# EAGLE design soil moisure (EAGLE 9.6.2)
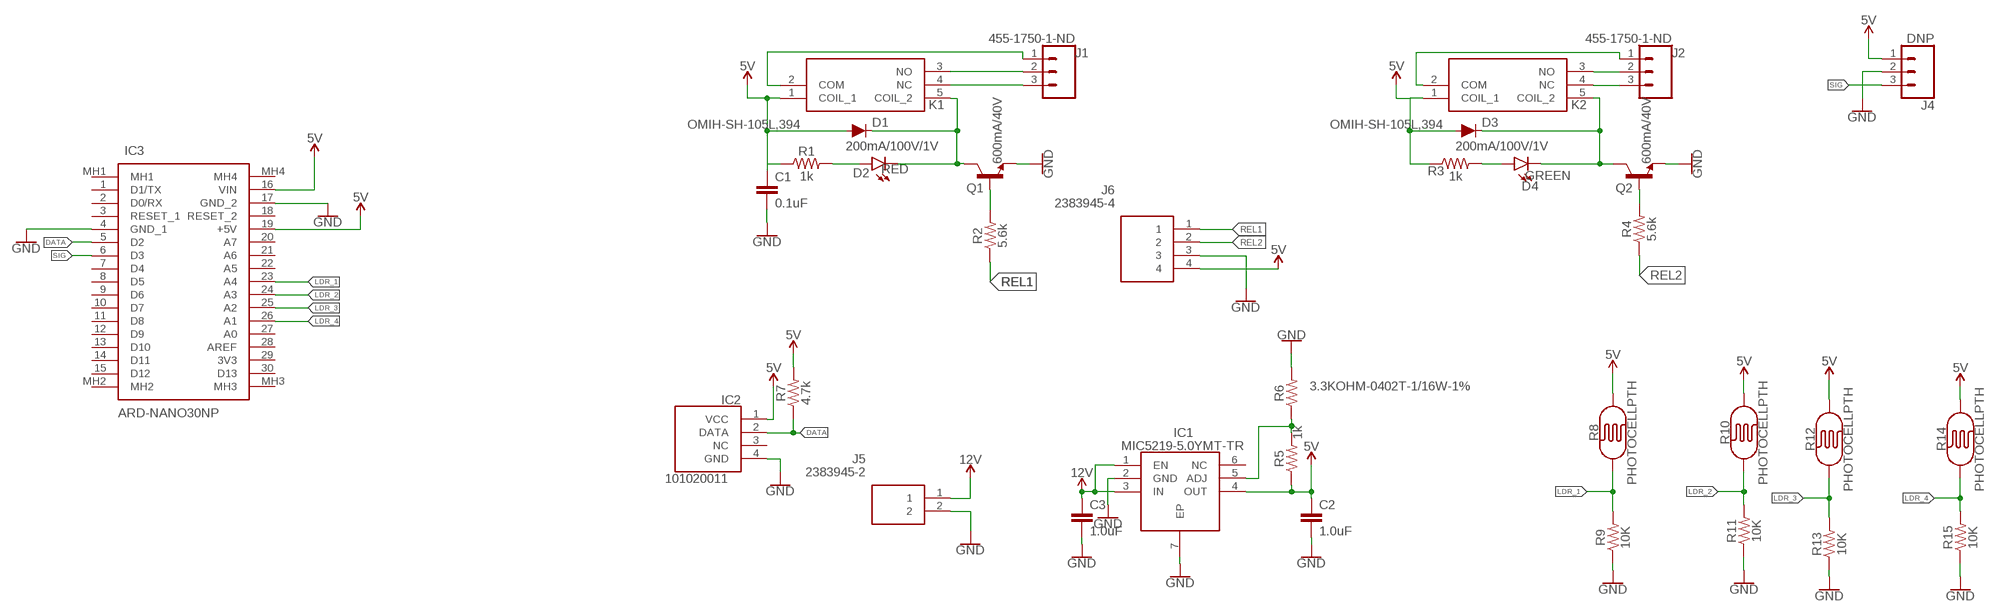
[diagram p0: schematic, sheet 1]

## Parts
C1  0.1uF  0.1UF-0402T-6.3V-10%-X7R  [0402-TIGHT]
C2  1.0uF  1.0UF-0402T-16V-10%  [0402-TIGHT]
C3  1.0uF  1.0UF-0402T-16V-10%  [0402-TIGHT]
D1  200mA/100V/1V  DIODE-1N4148  [DIODE-1N4148]
D2  RED  LED-RED0603  [LED-0603]
D3  200mA/100V/1V  DIODE-1N4148  [DIODE-1N4148]
D4  GREEN  LED-GREEN0603  [LED-0603]
IC1  MIC5219-5.0YMT-TR  [SON65P200X200X60-7N]
IC2  101020011  [HDRV4W80P0X254_1X4_1200X500X15]
IC3  ARD-NANO30NP  [ARDNANO30NP]
J1  455-1750-1-ND  CONN_03  [1X03]
J2  455-1750-1-ND  CONN_03  [1X03]
J4  DNP  CONN_03POLAR  [MOLEX-1X3]
J5  2383945-2  [23839452]
J6  2383945-4  [23839454]
K1  OMIH-SH-105L,394  [OMIHSH105L394]
K2  OMIH-SH-105L,394  [OMIHSH105L394]
Q1  600mA/40V  TRANS_NPN-MMBT2222AL  [SOT23-3]
Q2  600mA/40V  TRANS_NPN-MMBT2222AL  [SOT23-3]
R1  1k  1KOHM-0402T-1/16W-1%  [0402-TIGHT]
R2  5.6k  5.6KOHM-0603-1/10W-1%  [0603]
R3  1k  1KOHM-0402T-1/16W-1%  [0402-TIGHT]
R4  5.6k  5.6KOHM-0603-1/10W-1%  [0603]
R5  1k  1KOHM-0402T-1/16W-1%  [0402-TIGHT]
R6  3.3KOHM-0402T-1/16W-1%  [0402-TIGHT]
R7  4.7k  4.7KOHM-0402T-1/16W-1%  [0402-TIGHT]
R8  PHOTOCELLPTH  [PHOTOCELL]
R9  10K  10KOHM-0402-1/10W-0.1%  [0402-TIGHT]
R10  PHOTOCELLPTH  [PHOTOCELL]
R11  10K  10KOHM-0402-1/10W-0.1%  [0402-TIGHT]
R12  PHOTOCELLPTH  [PHOTOCELL]
R13  10K  10KOHM-0402-1/10W-0.1%  [0402-TIGHT]
R14  PHOTOCELLPTH  [PHOTOCELL]
R15  10K  10KOHM-0402-1/10W-0.1%  [0402-TIGHT]

## Nets
5V: C2.1 D1.A D3.A IC1.4(OUT) IC2.1(VCC) IC3.16(VIN) IC3.19(+5V) J4.1 J6.4 K1.1(COIL_1) K2.1(COIL_1) R1.1 R3.1 R5.1 R7.2 R8.2 R10.2 R12.2 R14.2
12V: C3.1 IC1.1(EN) IC1.3(IN) J5.1
DATA: IC2.2(DATA) IC3.5(D2) R7.1
GND: C1.2 C2.2 C3.2 IC1.2(GND) IC1.7(EP) IC2.4(GND) IC3.4(GND_1) IC3.17(GND_2) J4.2 J5.2 J6.3 Q1.2(E) Q2.2(E) R6.2 R9.1 R11.1 R13.1 R15.1
LDR_1: IC3.23(A4) R8.1 R9.2
LDR_2: IC3.24(A3) R10.1 R11.2
LDR_3: IC3.25(A2) R12.1 R13.2
LDR_4: IC3.26(A1) R14.1 R15.2
N$1: J1.3 K1.4(NC)
N$2: J1.2 K1.3(NO)
N$3: J1.1 K1.2(COM)
N$4: D1.C D2.C K1.5(COIL_2) Q1.3(C)
N$5: D2.A R1.2
N$6: J2.3 K2.4(NC)
N$7: Q1.1(B) R2.2
N$9: J2.2 K2.3(NO)
N$10: J2.1 K2.2(COM)
N$11: D3.C D4.C K2.5(COIL_2) Q2.3(C)
N$12: D4.A R3.2
N$13: Q2.1(B) R4.2
N$14: IC1.5(ADJ) R5.2 R6.1
N$15: C1.1
REL1: J6.1 R2.1
REL2: J6.2 R4.1
SIG: IC3.6(D3) J4.3
Unconnected: IC1.6(NC) IC2.3(NC) IC3.1(D1/TX) IC3.2(D0/RX) IC3.3(RESET_1) IC3.7(D4) IC3.8(D5) IC3.9(D6) IC3.10(D7) IC3.11(D8) IC3.12(D9) IC3.13(D10) IC3.14(D11) IC3.15(D12) IC3.18(RESET_2) IC3.20(A7) IC3.21(A6) IC3.22(A5) IC3.27(A0) IC3.28(AREF) IC3.29(3V3) IC3.30(D13) IC3.MH1 IC3.MH2 IC3.MH3 IC3.MH4

## Library data of the parts
C1 = SparkFun-Capacitors:0.1UF: 0.1µF ceramic capacitors A capacitor is a passive two-terminal electrical component used to store electrical energy temporarily in an electric field.; PROD_ID: CAP-14993
C2 C3 = SparkFun-Capacitors:1.0UF: 1µF ceramic capacitors A capacitor is a passive two-terminal electrical component used to store electrical energy temporarily in an electric field.; PROD_ID: CAP-12417
D1 D3 = SparkFun-DiscreteSemi:DIODE: Diode These are standard reverse protection diodes and small signal diodes. SparkFun Products: SparkFun SparkPunk Sound Kit <https://www.sparkfun.com/products/11177> SparkFun ESP8266 Thing <https://www.sparkfun.com/products/13231>; PROD_ID: DIO-08378
D2 = SparkFun-LED:LED-RED: Red SMD LED Used in manufacturing of most products at SparkFun Packages: 0603 - SMD 0603 package [Product Link] <http://docs.avagotech.com/docs/AV02-0551EN> 0603 SMART - SMD 0603 SMART package ( more efficient and expensive)[Product Link] <http://www.osram-os.com/Graphics/XPic2/00077099_0.pdf> 1206 - SMD1206 package [Product Link] <https://www.sparkfun.com/datasheets/DevTools/LilyPad/Q150OVS4.pdff> SparkFun Products: Pro Mini 328 -5V <https://www.sparkfun.com/products/821> RedBoard <https://www.sparkfun.com/products/12757> IOIO-OTG <https://www.sparkfun.com/products/13613>; PROD_ID: DIO-00819
D4 = SparkFun-LED:LED-GREEN: Green SMD LED Used in manufacturing of various products at SparkFun Packages: 0603 - SMD 0603 package [Product Link] <http://www.futureelectronics.com/en/technologies/semiconductors/optoelectronics/leds/Pages/9894312-LTST-C190GKT.aspx?CrossPart=HSMG-C190&IM=0> LilyPad 1206 - SMD1206 LilyPad package [Product Link] <http://www.futureelectronics.com/en/Technologies/Product.aspx?ProductID=IN150NGHARVATEKCORPORATION2049943&IM=0> 1206 - SMD1206 package [Product Link] <http://www.futureelectronics.com/en/technologies/semiconductors/optoelectronics/leds/Pages/8315665-LTST-C150KGKT.aspx?IM=0> 1206 Bottom Mount -SMD 1206 Bottom Mount [Product Link] <http://www.digikey.com/product-detail/en/lite-on-inc/LTST-C230KGKT/160-1456-1-ND/386854> SparkFun Products: Pro Mini 328 -5V <https://www.sparkfun.com/products/821> RedBoard <https://www.sparkfun.com/products/12757> MP3 Trigger <https://www.sparkfun.com/products/13720> Makey Makey <https://www.sparkfun.com/products/11076>; PROD_ID: DIO-00821
IC1 = MIC5219-5.0YMT-TR:MIC5219-5.0YMT-TR: LDO Voltage Regulators 500mA Peak Output LDO Source: Datasheet <https://datasheet.datasheetarchive.com/originals/dk/DKDS-15/280691.pdf>; ARROW_PART_NUMBER: MIC5219-5.0YMT-TR; ARROW_PRICE-STOCK: https://www.arrow.com/en/products/mic5219-5.0ymt-tr/microchip-technology?region=nac; DESCRIPTION: LDO Voltage Regulators 500mA Peak Output LDO; HEIGHT: 0.6mm; MANUFACTURER_NAME: Microchip; MANUFACTURER_PART_NUMBER: MIC5219-5.0YMT-TR; MOUSER_PART_NUMBER: 998-MIC5219-5.0YMTTR; MOUSER_PRICE-STOCK: https://www.mouser.co.uk/ProductDetail/Microchip-Technology-Micrel/MIC5219-50YMT-TR?qs=U6T8BxXiZAUlqYSj5RtOQw%3D%3D
IC2 = 101020011:101020011: Multiple Function Sensor Development Tools Grove - Temp&Humi Sensor Source: Datasheet <https://componentsearchengine.com/Datasheets/1/101020011.pdf>; ARROW_PART_NUMBER: 101020011; ARROW_PRICE-STOCK: https://www.arrow.com/en/products/101020011/seeed-technology-limited; DESCRIPTION: Multiple Function Sensor Development Tools Grove - Temp&Humi Sensor; HEIGHT: 15.5mm; MANUFACTURER_NAME: Seeed Studio; MANUFACTURER_PART_NUMBER: 101020011; MOUSER_PART_NUMBER: 713-101020011; MOUSER_PRICE-STOCK: https://www.mouser.co.uk/ProductDetail/Seeed-Studio/101020011?qs=1%252B9yuXKSi8Dq%252B99bte6U5Q%3D%3D
IC3 = ARD-NANO30NP:ARD-NANO30NP: Development Boards & Kits - AVR Arduino Nano 3.1 W/ATMEGA328 NO-PIN Source: Datasheet <http://www.mouser.com/datasheet/2/595/Arduino_Nano3_0-220057.pdf>; DESCRIPTION: Development Boards & Kits - AVR Arduino Nano 3.1 W/ATMEGA328 NO-PIN; HEIGHT: 5mm; MANUFACTURER_NAME: Gravitech; MANUFACTURER_PART_NUMBER: ARD-NANO30NP; MOUSER_PART_NUMBER: 992-ARD-NANO30NP; MOUSER_PRICE-STOCK: https://www.mouser.co.uk/ProductDetail/Gravitech/ARD-NANO30NP?qs=Vxac6xGyzPlh7in3DWNTbQ%3D%3D
J1 J2 = SparkFun-Connectors:CONN_03: Multi connection point. Often used as Generic Header-pin footprint for 0.1 inch spaced/style header connections On any of the 0.1 inch spaced packages, you can populate with these: Break Away Headers - Straight <https://www.sparkfun.com/products/116> (PRT-00116) Break Away Male Headers - Right Angle <https://www.sparkfun.com/products/553> (PRT-00553) Female Headers <https://www.sparkfun.com/products/115> (PRT-00115) Break Away Headers - Machine Pin <https://www.sparkfun.com/products/117> (PRT-00117) Break Away Female Headers - Swiss Machine Pin <https://www.sparkfun.com/products/743> (PRT-00743) Stackable Header - 3 Pin (Female, 0.1") <https://www.sparkfun.com/products/13875> (PRT-13875) For SCREWTERMINALS and SPRING TERMINALS visit here: Screw Terimnals on SparkFun.com <https://www.sparkfun.com/search/results?term=Screw+Terminals> (5mm/3.5mm/2.54mm spacing) This device is also useful as a general connection point to wire up your design to another part of your project. Our various solder wires solder well into these plated through hole pads. Hook-Up Wire - Assortment (Stranded, 22 AWG) <https://www.sparkfun.com/products/11375> (PRT-11375) Hook-Up Wire - Assortment (Solid Core, 22 AWG) <https://www.sparkfun.com/products/11367> (PRT-11367) View the entire wire category on our website here <https://www.sparkfun.com/categories/141> Special notes: Molex polarized connector foot print use with SKU : PRT-08232 with associated crimp pins and housings.; PROD_ID: XXX-00000
J4 = SparkFun-Connectors:CONN_03: Multi connection point. Often used as Generic Header-pin footprint for 0.1 inch spaced/style header connections On any of the 0.1 inch spaced packages, you can populate with these: Break Away Headers - Straight <https://www.sparkfun.com/products/116> (PRT-00116) Break Away Male Headers - Right Angle <https://www.sparkfun.com/products/553> (PRT-00553) Female Headers <https://www.sparkfun.com/products/115> (PRT-00115) Break Away Headers - Machine Pin <https://www.sparkfun.com/products/117> (PRT-00117) Break Away Female Headers - Swiss Machine Pin <https://www.sparkfun.com/products/743> (PRT-00743) Stackable Header - 3 Pin (Female, 0.1") <https://www.sparkfun.com/products/13875> (PRT-13875) For SCREWTERMINALS and SPRING TERMINALS visit here: Screw Terimnals on SparkFun.com <https://www.sparkfun.com/search/results?term=Screw+Terminals> (5mm/3.5mm/2.54mm spacing) This device is also useful as a general connection point to wire up your design to another part of your project. Our various solder wires solder well into these plated through hole pads. Hook-Up Wire - Assortment (Stranded, 22 AWG) <https://www.sparkfun.com/products/11375> (PRT-11375) Hook-Up Wire - Assortment (Solid Core, 22 AWG) <https://www.sparkfun.com/products/11367> (PRT-11367) View the entire wire category on our website here <https://www.sparkfun.com/categories/141> Special notes: Molex polarized connector foot print use with SKU : PRT-08232 with associated crimp pins and housings.; PROD_ID: CONN-08625; SF_ID: PRT-08096
J5 = 2383945-2:2383945-2: Pluggable Terminal Blocks TERMI-BLOK SMD MOUNT 180_2P_3.81 MM 12A Source: Datasheet <https://www.te.com/commerce/DocumentDelivery/DDEController?Action=showdoc&DocId=Customer Drawing2383945A1pdfEnglishENG_CD_2383945_A1.pdf2383945-2>; ARROW_PART_NUMBER: 2383945-2; ARROW_PRICE-STOCK: https://www.arrow.com/en/products/2383945-2/te-connectivity?region=nac; DESCRIPTION: Pluggable Terminal Blocks TERMI-BLOK SMD MOUNT 180_2P_3.81 MM 12A; HEIGHT: 8.65mm; MANUFACTURER_NAME: TE Connectivity; MANUFACTURER_PART_NUMBER: 2383945-2; MOUSER_PART_NUMBER: 571-2383945-2; MOUSER_PRICE-STOCK: https://www.mouser.co.uk/ProductDetail/TE-Connectivity/2383945-2?qs=QNEnbhJQKvZmFhNVRiwVMA%3D%3D
J6 = 2383945-4:2383945-4: Pluggable Terminal Blocks TERMI-BLOK SMD MOUNT 180_4P_3.81 MM 12A Source: Datasheet <https://www.te.com/commerce/DocumentDelivery/DDEController?Action=showdoc&DocId=Customer Drawing2383945A1pdfEnglishENG_CD_2383945_A1.pdf2383945-4>; ARROW_PART_NUMBER: 2383945-4; ARROW_PRICE-STOCK: https://www.arrow.com/en/products/2383945-4/te-connectivity?region=nac; DESCRIPTION: Pluggable Terminal Blocks TERMI-BLOK SMD MOUNT 180_4P_3.81 MM 12A; HEIGHT: 8.65mm; MANUFACTURER_NAME: TE Connectivity; MANUFACTURER_PART_NUMBER: 2383945-4; MOUSER_PART_NUMBER: 571-2383945-4; MOUSER_PRICE-STOCK: https://www.mouser.co.uk/ProductDetail/TE-Connectivity/2383945-4?qs=QNEnbhJQKvYZ69upIRuxlA%3D%3D
K1 K2 = OMIH-SH-105L_394:OMIH-SH-105L,394: TE CONNECTIVITY / OEG - OMIH-SH-105L,394 - RELAY, SPDT, 250VAC, 30VDC, 16A Source: Datasheet <http://www.te.com/commerce/DocumentDelivery/DDEController?Action=showdoc&DocId=Data SheetOMI_OMIH_series_relay_data_sheet_E0411pdfEnglishENG_DS_OMI_OMIH_series_relay_data_sheet_E_0411.pdf1-1461373-1>; DESCRIPTION: TE CONNECTIVITY / OEG - OMIH-SH-105L,394 - RELAY, SPDT, 250VAC, 30VDC, 16A; HEIGHT: 21mm; MANUFACTURER_NAME: TE Connectivity; MANUFACTURER_PART_NUMBER: OMIH-SH-105L,394; MOUSER_PART_NUMBER: 677-OMIH-SH-105L; MOUSER_PRICE-STOCK: https://www.mouser.co.uk/ProductDetail/TE-Connectivity-OEG/OMIH-SH-105L394?qs=YjZJnJrCSBR0E1q7WZc1bg%3D%3D
Q1 Q2 = SparkFun-DiscreteSemi:TRANS_NPN: NPN transistor Current controlled devices typically used to amplify current or used as a switch. BC547 - COM-08928 <http://www.sparkfun.com/products/8928> (TO-92 45V 100mA) (1.Collector 2.Base 3.Emitter) 2N3904 - COM-00521 <http://www.sparkfun.com/products/521> (TO-92 40V 200mA) (1.Emitter 2.Base 3.Collector) P2N2222A - COM-12852 <http://www.sparkfun.com/products/12852> (TO-92 40V 600mA) (1.Collector 2.Base 3.Emitter); PROD_ID: TRANS-08049
R1 R3 R5 = SparkFun-Resistors:1KOHM: 1kΩ resistor A resistor is a passive two-terminal electrical component that implements electrical resistance as a circuit element. Resistors act to reduce current flow, and, at the same time, act to lower voltage levels within circuits. - Wikipedia; PROD_ID: RES-14342
R2 R4 = SparkFun-Resistors:5.6KOHM: 5.6kΩ resistor A resistor is a passive two-terminal electrical component that implements electrical resistance as a circuit element. Resistors act to reduce current flow, and, at the same time, act to lower voltage levels within circuits. - Wikipedia; PROD_ID: RES-12378
R6 = SparkFun-Resistors:3.3KOHM: 3.3kΩ resistor A resistor is a passive two-terminal electrical component that implements electrical resistance as a circuit element. Resistors act to reduce current flow, and, at the same time, act to lower voltage levels within circuits. - Wikipedia; PROD_ID: RES-15923
R7 = SparkFun-Resistors:4.7KOHM: 4.7kΩ resistor A resistor is a passive two-terminal electrical component that implements electrical resistance as a circuit element. Resistors act to reduce current flow, and, at the same time, act to lower voltage levels within circuits. - Wikipedia; PROD_ID: RES-15343
R8 R10 R12 R14 = SparkFun-Sensors:PHOTOCELL: Photocell (Photodetector, Photo Resistor, CdS) This is a very small light sensor. A photocell changes (also called a photodetector, photo resistor, CdS or photoconductive cell) resistance depending on the amount of light it is exposed to. These little sensors make great ambient light triggers (when light in the room turns on, do something). Datasheet <http://cdn.sparkfun.com/datasheets/Sensors/LightImaging/SEN-09088.pdf> SparkFun Products Mini Photocell <https://www.sparkfun.com/products/9088> (SEN-09088); PROD_ID: COMP-09129; SF_ID: SEN-09088
R9 R11 R13 R15 = SparkFun-Resistors:10KOHM: 10kΩ resistor A resistor is a passive two-terminal electrical component that implements electrical resistance as a circuit element. Resistors act to reduce current flow, and, at the same time, act to lower voltage levels within circuits. - Wikipedia; PROD_ID: RES-16147

## Board
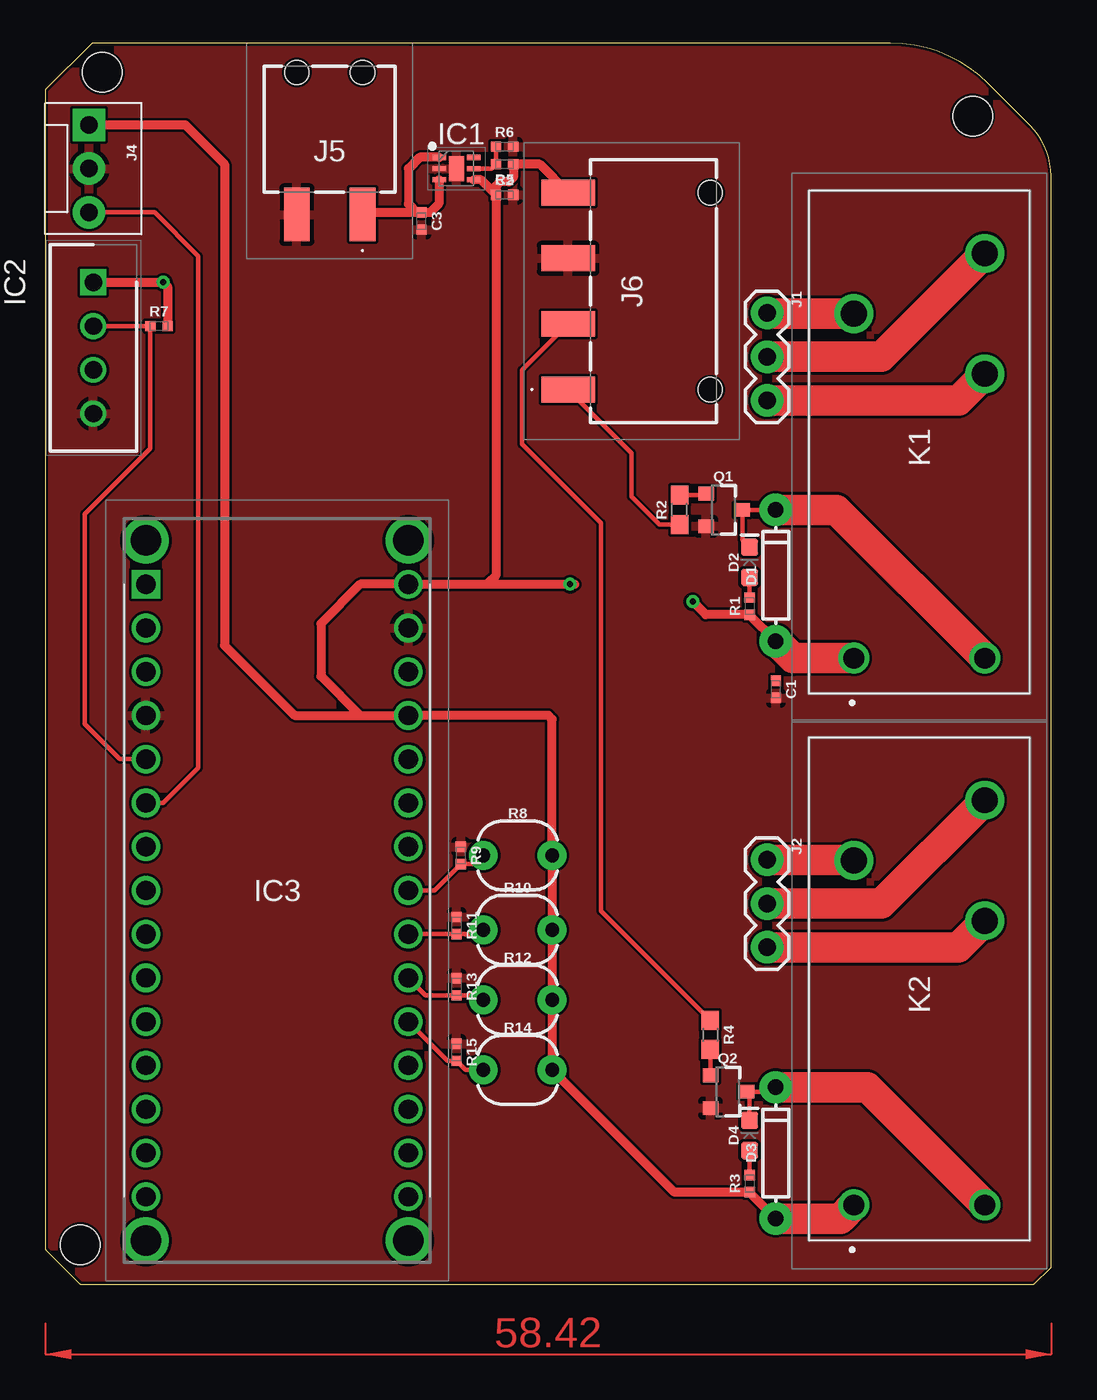
[diagram p1: board, top side]
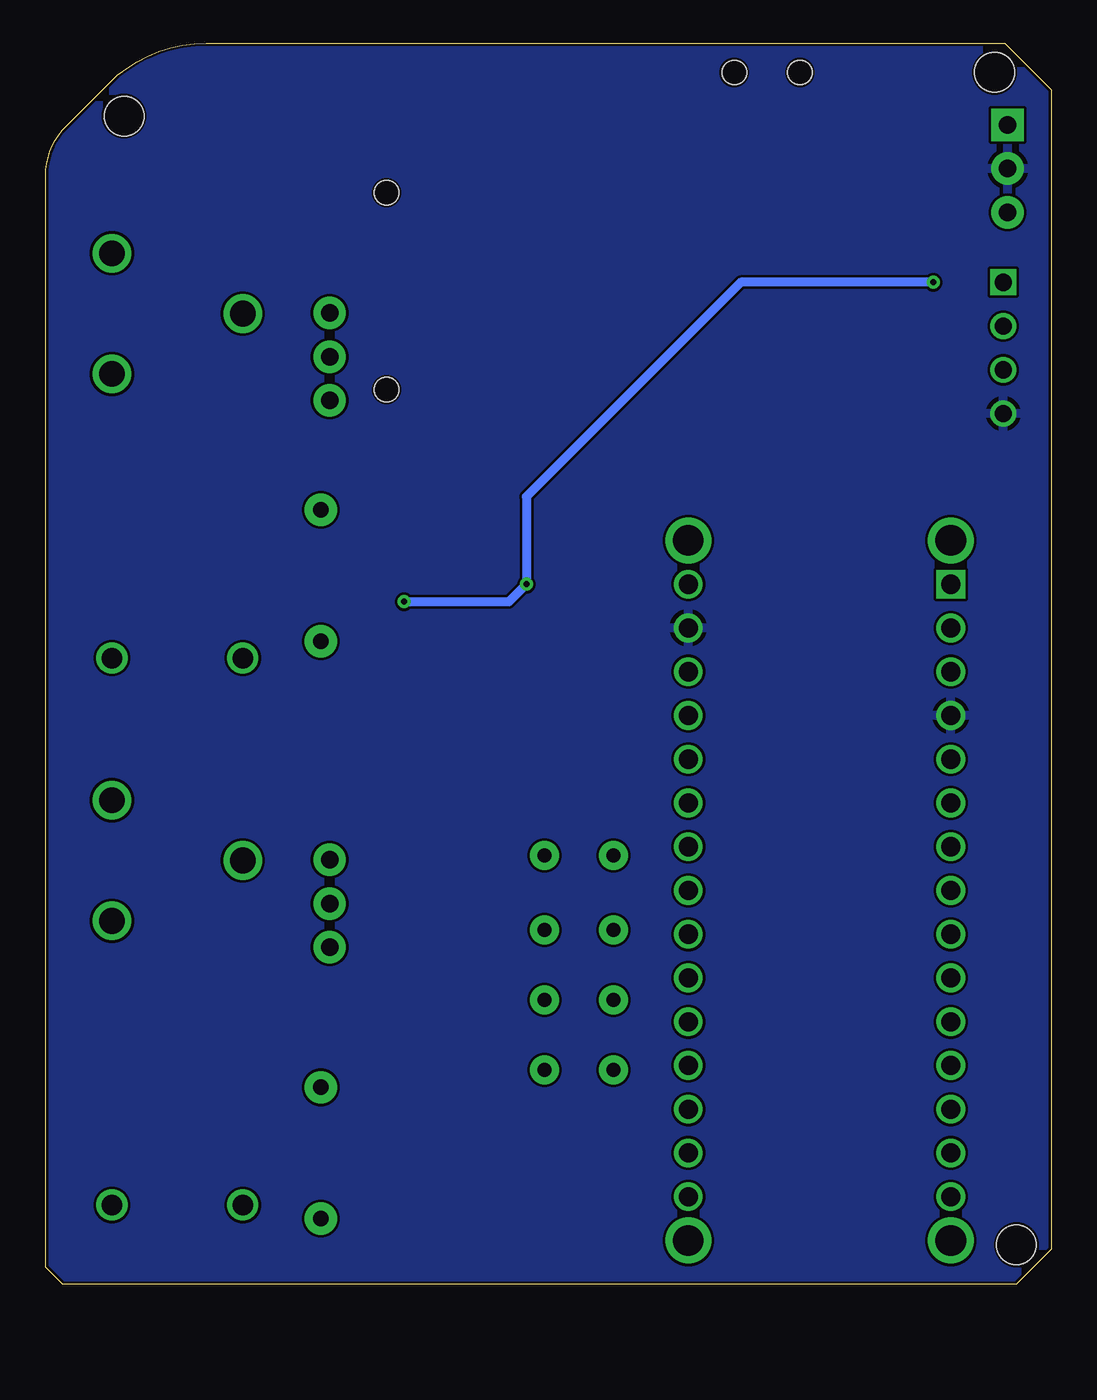
[diagram p2: board, bottom side, seen from below]

Size 58.4 x 72.06 mm. Coordinates in mm from the lower left corner, seen from the top.
Outline: 0,69.34 0,2.03 2.03,0 57.4,0 58.4,1 58.4,64.34 arc45 57.19,67.28 54.75,69.71 arc45 49.08,72.06 2.72,72.06 0,69.34
Copper layers (1*16): Top 0.035mm / dielectric 1.5mm / Bottom 0.035mm
Design rules "default *": minimum track width 6mil, minimum drill 0.35mm, track to track 6mil, track to pad 6mil, pad to pad 6mil, via to via 6mil, smd to smd 6mil, copper to edge 6mil, drill to drill 6mil, minimum pad ring 10mil, minimum via ring 8mil, stop-mask expansion 4mil, vias tented up to drill 0mil, thermal gap 10mil
Holes 2.29 mm at 53.85,67.82 2.03,2.29 3.3,70.36

### Footprints (pad centres in the part's own frame; a part is rotated, then mirrored left to right if it is on the bottom)
0402-TIGHT = smd 0.6 x 0.6: 1 -0.5,0; 2 0.5,0
DIODE-1N4148 = drill 0.9 pad 1.88: A -3.81,0; C 3.81,0
LED-0603 = smd 1 x 1: A -0.877,0; C 0.877,0
SON65P200X200X60-7N = smd 0.8 x 0.3: 1 -1,0.65; 2 -1,0; 3 -1,-0.65; 4 1,-0.65; 5 1,0; 6 1,0.65 | smd 0.85 x 1.45: 7 0,0
HDRV4W80P0X254_1X4_1200X500X15 = drill 1 pad 1.5 square: 1 0,0 | drill 1 pad 1.5: 2 2.54,0; 3 5.08,0; 4 7.62,0
ARDNANO30NP = drill 1.11 pad 1.665 square: 1 0,0 | drill 1.11 pad 1.665: 2 0,-2.54; 3 0,-5.08; 4 0,-7.62; 5 0,-10.16; 6 0,-12.7; 7 0,-15.24; 8 0,-17.78; 9 0,-20.32; 10 0,-22.86; 11 0,-25.4; 12 0,-27.94; 13 0,-30.48; 14 0,-33.02; 15 0,-35.56; 16 15.24,0; 17 15.24,-2.54; 18 15.24,-5.08; 19 15.24,-7.62; 20 15.24,-10.16; 21 15.24,-12.7; 22 15.24,-15.24; 23 15.24,-17.78; 24 15.24,-20.32; 25 15.24,-22.86; 26 15.24,-25.4; 27 15.24,-27.94; 28 15.24,-30.48; 29 15.24,-33.02; 30 15.24,-35.56 | drill 1.778 pad 2.667: MH1 0,2.54; MH2 0,-38.1; MH3 15.24,-38.1; MH4 15.24,2.54
1X03 = drill 1.016 pad 1.88: 1 0,0; 2 2.54,0; 3 5.08,0
MOLEX-1X3 = drill 1.016 pad 1.88 square: 1 0,0 | drill 1.016 pad 1.88: 2 2.54,0; 3 5.08,0
23839452 = smd 1.5 x 3.1: 1 -1.905,4.95; 2 1.905,4.95 | hole 1.4: -1.905,-3.3; 1.905,-3.3
23839454 = smd 1.5 x 3.1: 1 -5.715,4.95; 2 -1.905,4.95; 3 1.905,4.95; 4 5.715,4.95 | hole 1.4: -5.715,-3.3; 5.715,-3.3
OMIHSH105L394 = drill 1.2 pad 1.8: 1 -27.15,10.2; 5 -27.15,2.6 | drill 1.5 pad 2.25: 2 -7.15,10.2; 3 -3.65,2.6; 4 -10.65,2.6
SOT23-3 = smd 0.8 x 0.9: 1 -0.95,-1; 2 0.95,-1; 3 0,1.1
0603 = smd 1.1 x 1: 1 -0.85,0; 2 0.85,0
PHOTOCELL = drill 0.8 pad 1.676: 1 -2,0; 2 2,0

### Placement (x,y rotation side)
C1  42.42,34.54 270 top
C2  26.67,63.25 0 top
C3  21.84,61.72 270 top
D1  42.42,41.15 90 top
D2  40.89,41.91 90 top
D3  42.42,7.62 90 top
D4  40.89,8.64 90 top
IC1  23.88,64.77 0 top
IC2  2.79,58.17 270 top
IC3  5.84,40.64 0 top
J1  41.91,56.39 270 top
J2  41.91,24.64 270 top
J4  2.54,67.31 270 top
J5  16.51,67.06 180 top
J6  35.31,57.66 90 top
K1  57.15,63.5 90 top
K2  57.15,31.75 90 top
Q1  39.37,44.96 270 top
Q2  39.62,11.18 270 top
R1  40.89,39.37 90 top
R2  36.83,44.96 90 top
R3  40.89,5.84 90 top
R4  38.61,14.48 270 top
R5  26.67,65.02 180 top
R6  26.67,66.04 0 top
R7  6.6,55.63 0 top
R8  27.43,24.89 0 top
R9  24.13,24.89 270 top
R10  27.43,20.57 0 top
R11  23.88,20.83 270 top
R12  27.43,16.51 0 top
R13  23.88,17.27 270 top
R14  27.43,12.45 0 top
R15  23.88,13.46 270 top

### Tracks (layer width: path | path; a pad name or v marks a point on that pad's centre or on a via)
5V  (via drill 0.35)
  Top 0.508: IC1.4 25.3,64.12 C2.1 | R5.1 | R5.1 27.18,64.26 26.92,64.01 26.42,64.01 26.17,63.76 C2.1 | D1.A R1.1 38.35,38.87 v37.59,39.62 | D3.A R3.1 36.54,5.34 R14.2 R12.2 R10.2 R8.2 29.43,32.8 29.21,33.02 IC3.19 18.29,33.02 | 25.65,40.64 IC3.16 18.29,40.64 16,38.35 16,35.31 18.29,33.02 | 25.65,40.64 v30.48,40.64 30.73,40.64 | IC2.1 v6.86,58.17 7.1,57.92 R7.2 | J4.1 8.13,67.31 10.41,65.02 10.41,37.08 14.48,33.02 18.29,33.02 | C2.1 26.17,41.16 25.65,40.64 | J6.4 28.71,65.02 R5.1
  Top 1.778: K2.1 46.16,3.81 D3.A | K1.1 43.41,36.35 D1.A
  Bottom 0.508: v6.86,58.17 18.03,58.17 30.48,45.72 v30.48,40.64 31.5,39.62 v37.59,39.62
12V
  Top 0.508: 21.59,62.22 C3.1 22.34,62.22 22.86,62.74 22.86,64.1 IC1.3 | 21.59,62.22 18.53,62.22 J5.1 | IC1.1 21.73,65.42 21.08,64.77 21.08,62.73 21.59,62.22
DATA
  Top 0.254: IC2.2 R7.1 6.1,48.52 2.29,44.7 2.29,32.51 4.32,30.48 IC3.5
GND
  pour Top: 1.78,75.95 55.37,75.95 62.23,69.09 62.23,-1.78 56.9,-7.11 0,-7.11 -7.37,0.25 -7.37,66.8
  pour Bottom: 1.02,77.72 55.63,77.72 64.52,68.83 64.52,-1.78 56.39,-9.91 -1.02,-9.91 -10.41,-0.51 -10.41,66.29
LDR_1
  Top 0.254: R8.1 24.93,24.39 R9.2 22.6,22.86 IC3.23
LDR_2
  Top 0.254: R10.1 25.18,20.32 24.38,20.32 24.37,20.33 R11.2 IC3.24
LDR_3
  Top 0.254: R12.1 25.43,16.77 R13.2 22.09,16.77 IC3.25
LDR_4
  Top 0.254: R14.1 24.39,12.45 R15.2 23.36,12.96 IC3.26
N$1
  Top 1.778: K1.4 53.01,51.31 J1.3
N$2
  Top 1.778: J1.2 48.55,53.85 K1.3
N$3
  Top 1.778: K1.2 41.95,56.35 J1.1
N$4
  Top 0.254: D2.C 40.47,43.21 Q1.3 D1.C
  Top 1.778: K1.5 45.94,44.96 D1.C
N$5
  Top 0.254: R1.2 D2.A
N$6
  Top 1.778: J2.3 53.01,19.56 K2.4
N$7
  Top 0.254: 37.02,45.81 R2.2 38.27,45.81 Q1.1
N$9
  Top 1.778: J2.2 48.55,22.1 K2.3
N$10
  Top 1.778: J2.1 46.91,24.64 K2.2
N$11
  Top 0.254: D4.C 40.89,11.01 Q2.3 42.16,11.18 D3.C
  Top 1.778: K2.5 47.72,11.43 D3.C
N$12
  Top 0.254: R3.2 D4.A
N$13
  Top 0.254: R4.2 38.62,13.61 Q2.1
N$14
  Top 0.254: R6.1 R5.2 25.92,64.77 IC1.5
REL1
  Top 0.254: J6.1 34.04,48.26 34.04,45.72 35.65,44.11 R2.1
REL2
  Top 0.254: 38.52,15.24 R4.1 32.26,21.68 32.26,44.2 27.69,48.77 27.69,53.08 J6.2
SIG
  Top 0.254: J4.3 6.35,62.23 8.89,59.69 8.89,29.97 6.86,27.94 IC3.6
(copper drawn outside any net)
  shapes: Top area x2